# EAGLE design mainboard_v6.0.3 (EAGLE 9.6.2)
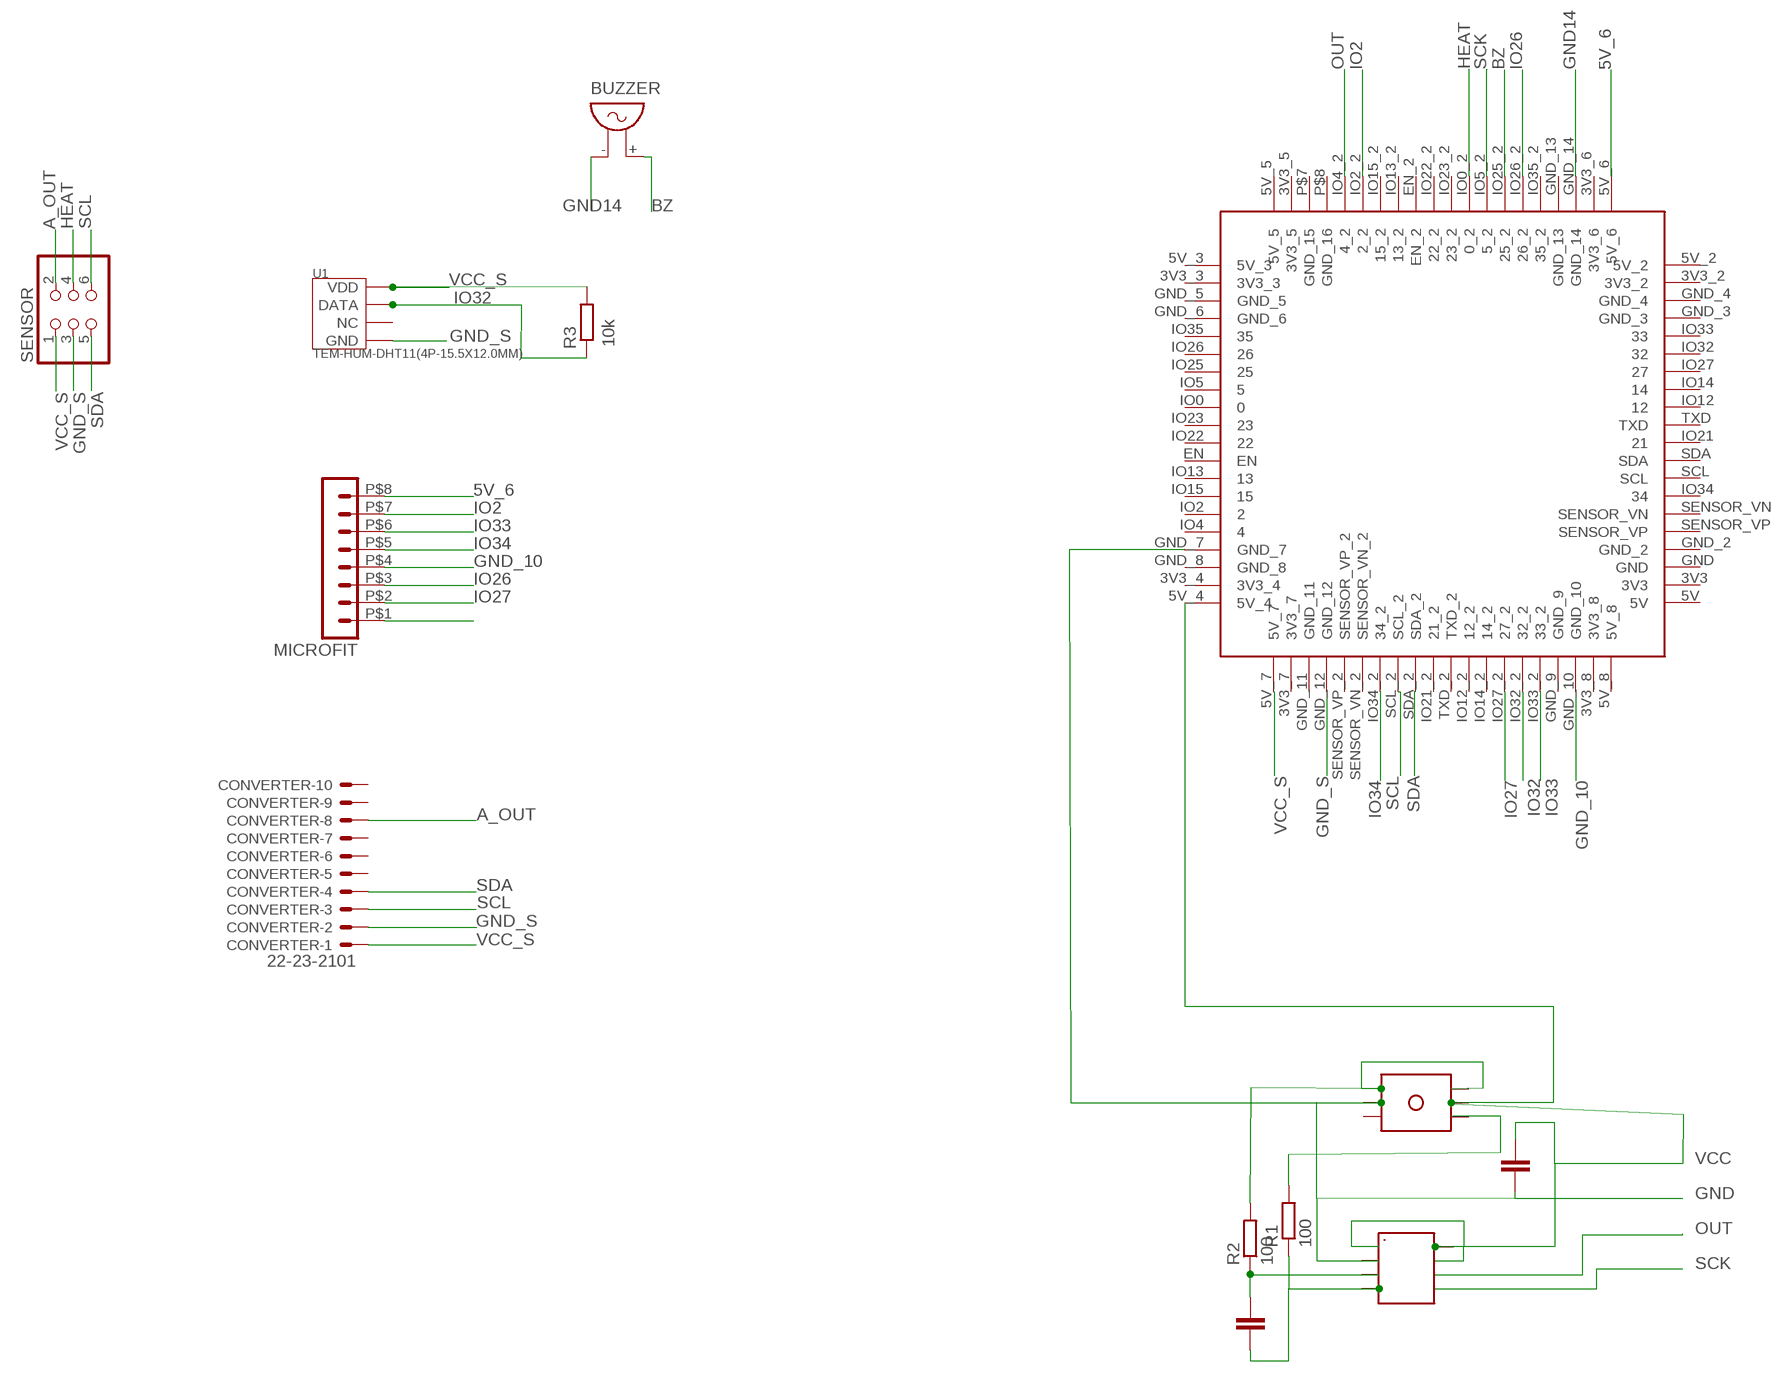
[diagram p0: schematic, sheet 1]

## Parts
BUZZER  F/QMX  [F/QMX]
C1  100n  C-EUC0805  [C0805]
C2  100n  C-EUC0805  [C0805]
CONVERTER  22-23-2101  [22-23-2101]
MICROFIT  HEADER_POS8_43045-0800  [43045-0800]
R1  100  R-EU_R0805  [R0805]
R2  100  R-EU_R0805  [R0805]
R3  10k  R-EU_R0805  [R0805]
SENSOR  PINHD-2X3  [2X03]
U1  TEM-HUM-DHT11(4P-15.5X12.0MM)  [SNR4-2.54-15.5X12.0X5.5MM]
U$1  WT32_SC01WT32_D  [WT32_DUPLICATED]
U$2  HX710B  [HX710B_SMD]
U$3  PRESSUREPRESSURE_PTH  [PRESSURE_PTH]

## Nets
5V_6: MICROFIT.P$8 U$1.5V_6
A_OUT: CONVERTER.8 SENSOR.2
BZ: BUZZER.+ U$1.IO25_2(25_2)
GND: C2.2 U$1.GND_7 U$2.AGND U$3.2
GND14: BUZZER.- U$1.GND_14
GND_10: MICROFIT.P$4 U$1.GND_10
GND_S: CONVERTER.2 SENSOR.3 U1.4(GND) U$1.GND_12
HEAT: SENSOR.4 U$1.IO0_2(0_2)
IO2: MICROFIT.P$7 U$1.IO2_2(2_2)
IO26: MICROFIT.P$3 U$1.IO26_2(26_2)
IO27: MICROFIT.P$2 U$1.IO27_2(27_2)
IO32: R3.1 U1.2(DATA) U$1.IO32_2(32_2)
IO33: MICROFIT.P$6 U$1.IO33_2(33_2)
IO34: MICROFIT.P$5 U$1.IO34_2(34_2)
N$1: C1.2 R2.1 U$2.INN
N$2: C1.1 R1.1 U$2.INP
N$5: R1.2 U$3.4
N$7: R2.2 U$3.1 U$3.6
N$8: MICROFIT.P$1
OUT: U$1.IO4_2(4_2) U$2.DOUT
SCK: U$1.IO5_2(5_2) U$2.SCK
SCL: CONVERTER.3 SENSOR.6 U$1.SCL_2
SDA: CONVERTER.4 SENSOR.5 U$1.SDA_2
VCC: C2.1 U$1.5V_4 U$2.AVDD U$2.DVDD U$2.VREF U$3.5
VCC_S: CONVERTER.1 R3.2 SENSOR.1 U1.1(VDD) U$1.5V_7
Unconnected: CONVERTER.5 CONVERTER.6 CONVERTER.7 CONVERTER.9 CONVERTER.10 U1.3(NC) U$1.3V3 U$1.3V3_2 U$1.3V3_3 U$1.3V3_4 U$1.3V3_5 U$1.3V3_6 U$1.3V3_7 U$1.3V3_8 U$1.5V U$1.5V_2 U$1.5V_3 U$1.5V_5 U$1.5V_8 U$1.EN U$1.EN_2 U$1.GND U$1.GND_2 U$1.GND_3 U$1.GND_4 U$1.GND_5 U$1.GND_6 U$1.GND_8 U$1.GND_9 U$1.GND_11 U$1.GND_13 U$1.IO0 U$1.IO2 U$1.IO4 U$1.IO5 U$1.IO12 U$1.IO12_2(12_2) U$1.IO13 U$1.IO13_2(13_2) U$1.IO14 U$1.IO14_2(14_2) U$1.IO15 U$1.IO15_2(15_2) U$1.IO21 U$1.IO21_2(21_2) U$1.IO22 U$1.IO22_2(22_2) U$1.IO23 U$1.IO23_2(23_2) U$1.IO25 U$1.IO26 U$1.IO27 U$1.IO32 U$1.IO33 U$1.IO34 U$1.IO35 U$1.IO35_2(35_2) U$1.P$7(GND_15) U$1.P$8(GND_16) U$1.SCL U$1.SDA U$1.SENSOR_VN U$1.SENSOR_VN_2 U$1.SENSOR_VP U$1.SENSOR_VP_2 U$1.TXD U$1.TXD_2 U$3.3

## Library data of the parts
BUZZER = buzzer:F/QMX: BUZZER Source: Buerklin; OC_FARNELL: unknown; OC_NEWARK: unknown
C1 C2 = rcl@1:C-EU: CAPACITOR, European symbol
CONVERTER = con-molex:22-23-2101: .100" (2.54mm) Center Header - 10 Pin; MF: MOLEX; MPN: 22-23-2101; OC_FARNELL: 1756828; OC_NEWARK: 94C0765
MICROFIT = con-molex-micro-fit-3_0 (1):HEADER_POS8_?: Molex - Micro-Fit 3.0 Series connector, 3.00mm (0.118") pitch header, 8 positions.
R1-R3 = rcl:R-EU_: RESISTOR, European symbol; SPICEPREFIX: R
SENSOR = pinhead:PINHD-2X3: PIN HEADER
U1 = TEM-HUM-DHT11_4P-15.5X12.0MM_:TEM-HUM-DHT11(4P-15.5X12.0MM): 314010000 Check availability <https://pricing.snapeda.com/parts/DHT11/Panasonic%20Industrial%20Automation%20Sales/view-part?ref=eda>; AVAILABILITY: Not in stock; CHECK_PRICES: https://www.snapeda.com/parts/DHT11/Panasonic/view-part/?ref=eda; DESCRIPTION: Servo AC 100 ~ 120VAC Supply 10A 120V Load; MF: Panasonic Industrial Automation Sales; MP: DHT11; PACKAGE: None; PRICE: None; SNAPEDA_LINK: https://www.snapeda.com/parts/DHT11/Panasonic/view-part/?ref=snap
U$1 = WT32_SC01:WT32_SC01
U$2 = HX710B:HX710B
U$3 = PRESSURE:PRESSURE

## Board
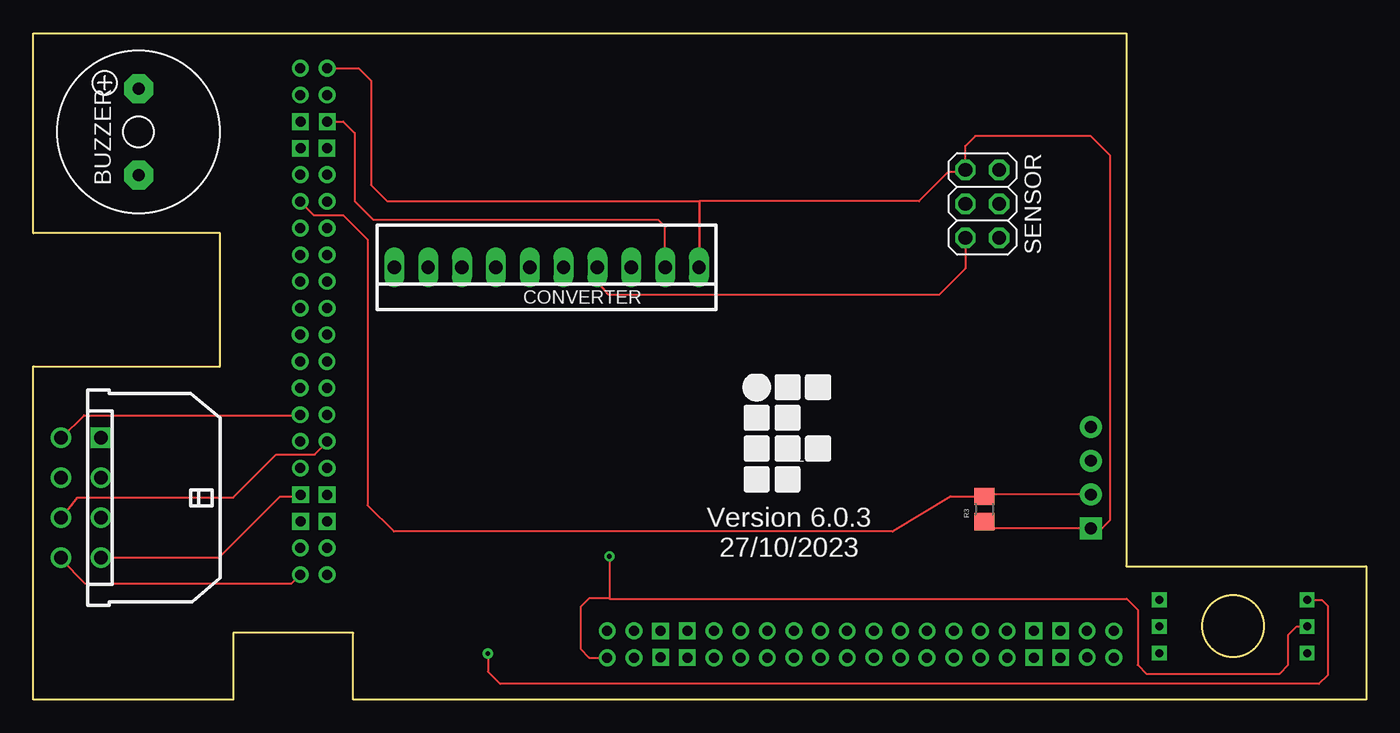
[diagram p1: board, top side]
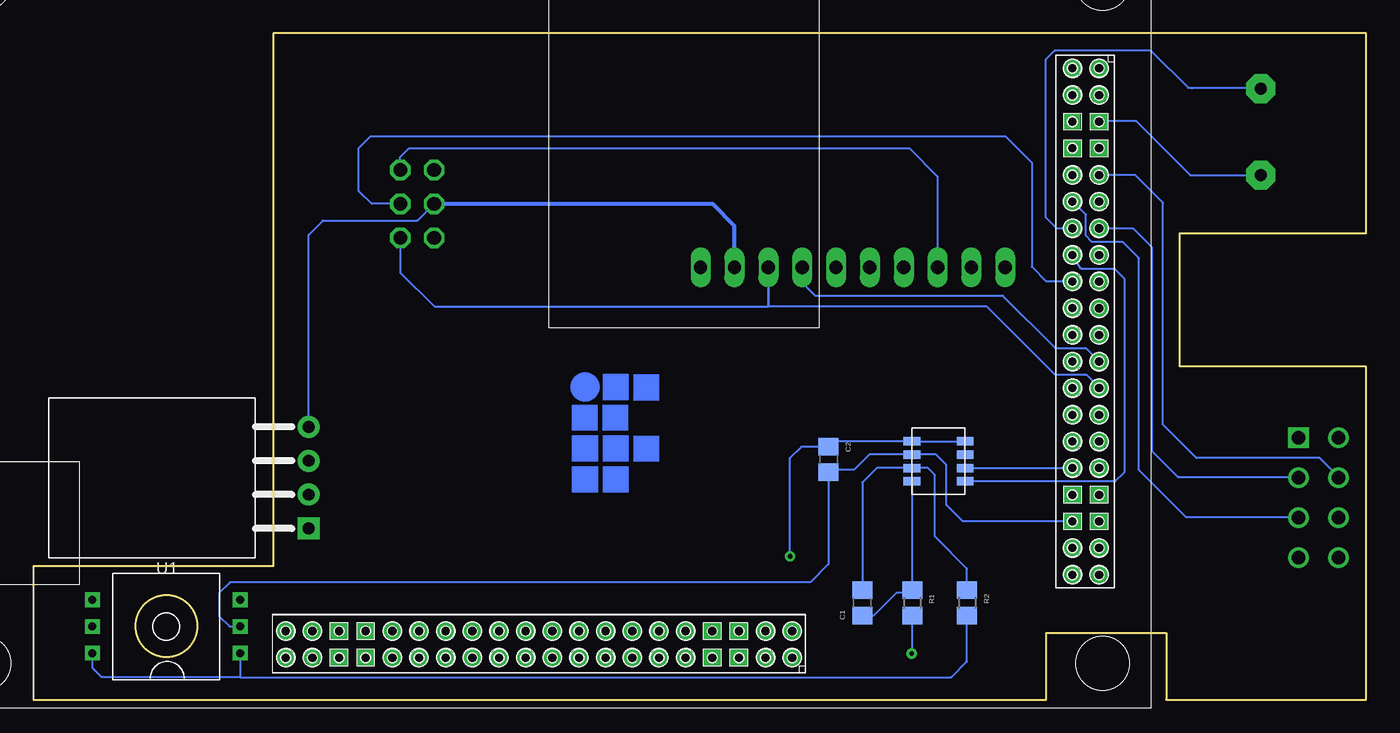
[diagram p2: board, bottom side, seen from below]

Size 100 x 50 mm. Coordinates in mm from the lower left corner, seen from the top.
Outline: 0,0 0,25 14,25 14,35 0,35 0,50 82,50 82,10 100,10 100,0 24,0 24,5 15,5 15,0 0,0
Outline: circle at 90,5.5 radius 2.3
Copper layers (1*16): Top 0.035mm / dielectric 1.5mm / Bottom 0.035mm
Design rules "default": minimum track width 6mil, minimum drill 0.35mm, track to track 6mil, track to pad 6mil, pad to pad 6mil, via to via 6mil, smd to smd 6mil, copper to edge 40mil, drill to drill 6mil, minimum pad ring 10mil, minimum via ring 8mil, stop-mask expansion 4mil, vias tented up to drill 0mil, thermal gap 10mil

### Footprints (pad centres in the part's own frame; a part is rotated, then mirrored left to right if it is on the bottom)
F/QMX = drill 0.914 pad 2.159 octagon: + 3.251,0; - -3.251,0
C0805 = smd 1.3 x 1.5: 1 -0.95,0; 2 0.95,0
22-23-2101 = drill 1 long: 1 -11.43,0; 2 -8.89,0; 3 -6.35,0; 4 -3.81,0; 5 -1.27,0; 6 1.27,0; 7 3.81,0; 8 6.35,0; 9 8.89,0; 10 11.43,0
43045-0800 = drill 1.02 square: P$1 4.5,4.32 | drill 1.02: P$2 1.5,4.32; P$3 -1.5,4.32; P$4 -4.5,4.32; P$5 4.5,7.32; P$6 1.5,7.32; P$7 -1.5,7.32; P$8 -4.5,7.32
R0805 = smd 1.3 x 1.5: 1 -0.95,0; 2 0.95,0
2X03 = drill 1.016 octagon: 1 -2.54,-1.27; 2 -2.54,1.27; 3 0,-1.27; 4 0,1.27; 5 2.54,-1.27; 6 2.54,1.27
SNR4-2.54-15.5X12.0X5.5MM = drill 0.889 pad 1.651 square: 1 -11.75,3.81 | drill 0.889 pad 1.651: 2 -11.75,1.27; 3 -11.75,-1.27; 4 -11.75,-3.81
WT32_DUPLICATED = drill 0.75: 3V3 -34.46,-21.65; 3V3_2 -34.47,-23.64; 3V3_3 -0.47,-21.65; 3V3_4 -0.47,-23.66; 3V3_5 22.56,-15.42; 3V3_6 24.57,-15.42; 3V3_7 22.56,18.57; 3V3_8 24.57,18.57; 5V -36.47,-21.66; 5V_2 -36.46,-23.65; 5V_3 1.54,-21.65; 5V_4 1.54,-23.66; 5V_5 22.56,-17.43; 5V_6 24.57,-17.43; 5V_7 22.56,20.58; 5V_8 24.57,20.58; EN -20.46,-21.65; EN_2 22.57,-1.43; IO0 -14.46,-21.65; IO0_2 22.56,4.58; IO2 -26.46,-21.66; IO2_2 22.56,-7.42; IO4 -28.46,-21.66; IO4_2 22.56,-9.43; IO5 -12.46,-21.65; IO5_2 22.56,6.57; IO12 -14.46,-23.65; IO12_2 24.57,4.58; IO13 -22.46,-21.66; IO13_2 22.57,-3.42; IO14 -12.46,-23.66; IO14_2 24.57,6.57; IO15 -24.46,-21.66; IO15_2 22.57,-5.43; IO21 -18.46,-23.65; IO21_2 24.58,0.58; IO22 -18.47,-21.66; IO22_2 22.57,0.58; IO23 -16.46,-21.66; IO23_2 22.56,2.57; IO25 -10.47,-21.65; IO25_2 22.56,8.58; IO26 -8.47,-21.65; IO26_2 22.56,10.58; IO27 -10.47,-23.66; IO27_2 24.57,8.58; IO32 -8.47,-23.66; IO32_2 24.57,10.58; IO33 -6.46,-23.66; IO33_2 24.57,12.59; IO34 -24.47,-23.66; IO34_2 24.58,-5.43; IO35 -6.46,-21.65; IO35_2 22.56,12.59; SCL -22.45,-23.66; SCL_2 24.58,-3.42; SDA -20.47,-23.66; SDA_2 24.58,-1.43; SENSOR_VN -26.47,-23.66; SENSOR_VN_2 24.57,-7.42; SENSOR_VP -28.47,-23.66; SENSOR_VP_2 24.57,-9.43; TXD -16.47,-23.66; TXD_2 24.57,2.57 | drill 0.75 square: GND -32.47,-21.65; GND_2 -30.47,-21.65; GND_3 -32.47,-23.65; GND_4 -30.47,-23.65; GND_5 -4.47,-21.65; GND_6 -2.46,-21.66; GND_7 22.56,-13.43; GND_8 22.56,-11.43; GND_9 24.55,-13.43; GND_10 24.55,-11.43; GND_11 22.57,14.58; GND_12 22.54,16.57; GND_13 24.56,14.57; GND_14 24.56,16.56; P$7 -4.47,-23.65; P$8 -2.47,-23.64
HX710B_SMD = smd 1.27 x 0.635: AGND -5,4; AVDD -1,5; DOUT -1,3; DVDD -1,4; INN -5,3; INP -5,2; SCK -1,2; VREF -5,5
PRESSURE_PTH = drill 0.6 square: 1 -10.54,7; 2 -10.54,5; 3 -10.54,3; 4 0.54,3; 5 0.54,5; 6 0.54,7

### Placement (x,y rotation side)
BUZZER  7.9,42.6 90 top
C1  37.81,7.25 90 bottom
C2  40.33,18.02 270 bottom
CONVERTER  38.51,32.45 180 top
MICROFIT  9.4,15.15 90 top
R1  34.06,7.25 270 bottom
R2  29.94,7.25 270 bottom
R3  71.35,14.3 270 top
SENSOR  71.2,37.2 270 top
U1  91.1,16.65 180 bottom
U$1  44.6,26.8 0 bottom
U$2  29.09,14.38 0 bottom
U$3  95.03,10.48 180 bottom

### Tracks (layer width: path | path; a pad name or v marks a point on that pad's centre or on a via)
5V_6
  Top 0.152: U$1.5V_6 19.36,8.7 3.9,8.7 2.08,10.52 MICROFIT.P$8
A_OUT
  Bottom 0.152: CONVERTER.8 32.16,39.25 34.28,41.37 71.82,41.37 72.47,40.72 SENSOR.2
BZ
  Bottom 0.152: 13.05,45.85 13.11,45.91 | U$1.IO25_2 23.24,35.38 24.06,36.2 24.06,48.01 23.38,48.69 16.14,48.69 13.36,45.91 13.11,45.91 | 13.11,45.91 7.96,45.91 BUZZER.+
GND
  Bottom 0.152: U$3.2 85.28,5.48 86.05,6.25 86.05,8 85.25,8.8 41.7,8.8 40.33,10.17 C2.2 40.13,17.27 38.38,17.27 37.27,18.38 U$2.AGND 32.28,18.38 31.5,17.6 31.5,14.6 30.27,13.37 U$1.GND_7
GND14
  Bottom 0.152: U$1.GND_14 20,43.4 17.25,43.4 13.2,39.35 BUZZER.-
GND_10
  Top 0.152: U$1.GND_10 19.96,15.24 18.5,15.24 13.91,10.65 MICROFIT.P$4
GND_S
  Top 0.152: U$1.GND_12 23.26,43.37 24.11,42.52 24.11,37.42 25.55,35.98 46.9,35.98 47.4,35.48 CONVERTER.2
  Bottom 0.152: U1.4 79.35,34.86 78.26,35.95 71.18,35.95 SENSOR.3
  Bottom 0.305: SENSOR.3 49.05,37.2 47.4,35.55 CONVERTER.2
HEAT
  Bottom 0.152: SENSOR.4 74.61,37.2 75.58,38.17 75.58,41.4 74.71,42.27 27.06,42.27 25.09,40.3 25.09,32.48 23.99,31.38 U$1.IO0_2
IO2
  Top 0.152: U$1.IO2_2 22.04,19.31 21.12,18.39 18.23,18.39 15.01,15.17 3.31,15.17 MICROFIT.P$7
IO26
  Bottom 0.152: MICROFIT.P$3 5.13,13.7 13.52,13.7 17.05,17.23 17.05,33.13 18.26,34.34 20.57,34.34 21.03,34.8 21.03,36.41 21.95,37.33 21.95,37.34 U$1.IO26_2
IO27
  Bottom 0.152: U$1.IO27_2 17.49,35.38 16.05,33.93 16.05,18.63 14.12,16.71 5.14,16.71 MICROFIT.P$2
IO32
  Top 0.152: U1.2 71.48,15.38 R3.1 68.84,15.25 64.48,12.61 27.05,12.61 25.08,14.58 25.08,34.53 23.28,36.33 21.08,36.33 U$1.IO32_2
IO33
  Bottom 0.152: U$1.IO33_2 17.35,39.39 15.24,37.28 15.24,20.64 12.73,18.13 3.5,18.13 2.13,16.76 MICROFIT.P$6
IO34
  Top 0.152: U$1.IO34_2 19.96,21.34 3.81,21.34 2.13,19.66 MICROFIT.P$5
N$1
  Bottom 0.152: C1.2 37.81,16.29 36.72,17.38 U$2.INN 32.88,17.38 32.35,16.85 32.35,12.23 29.94,9.82 R2.1
N$2
  Bottom 0.152: U$2.INP 34.09,8.23 R1.1 34.23,8.04 35.21,8.04 36.95,6.3 C1.1
N$5  (via drill 0.35)
  Top 0.152: U$3.4 96.67,7.48 97.1,7.05 97.1,1.82 96.45,1.17 35.03,1.17 34.1,2.1 v34.1,3.45
  Bottom 0.152: R1.2 34.1,6.26 v34.1,3.45
N$7
  Bottom 0.152: R2.2 29.94,2.86 31.13,1.67 84.49,1.67 U$3.1 84.49,1.68 94.86,1.68 95.57,2.4 U$3.6
OUT
  Bottom 0.152: 30.14,17.32 30.09,17.37 U$2.DOUT U$1.IO4_2
SCK
  Bottom 0.152: U$2.SCK 30.09,16.36 18.84,16.36 18.15,17.05 18.15,31.6 18.91,32.36 21.39,32.36 U$1.IO5_2
SCL
  Top 0.152: 72.39,34.59 SENSOR.6
  Bottom 0.152: U$1.SCL_2 20.02,23.41 20.99,24.38 23.34,24.38 28.49,29.53 44.86,29.53 CONVERTER.3 44.86,29.5 69.91,29.5 72.47,32.06 SENSOR.6
SDA
  Top 0.152: 20,25.39 U$1.SDA_2 | SENSOR.5 69.93,32.35 67.96,30.38 43.16,30.38 42.32,31.38 CONVERTER.4
  Bottom 0.152: U$1.SDA_2 20.12,25.45 20.13,25.45 21.05,26.37 23.32,26.37 27.28,30.33 41.37,30.33 42.32,31.28 CONVERTER.4
VCC  (via drill 0.35)
  Top 0.152: 95.43,5.48 U$3.5 94.78,5.48 94.15,4.85 94.15,2.6 93.5,1.95 83.5,1.95 82.85,2.6 82.85,6.75 82.03,7.57 43.22,7.57 v43.22,10.74 43.22,7.59 41.69,7.59 41.06,6.96 41.06,3.79 41.71,3.14 U$1.5V_4
  Bottom 0.152: U$2.DVDD U$2.AVDD U$2.VREF 34.11,19.4 39.9,19.4 C2.1 42.38,18.97 43.22,18.13 v43.22,10.74 43.22,10.67
VCC_S
  Top 0.152: R3.2 71.61,12.84 U1.1 80.17,12.84 80.77,13.44 80.77,40.86 79.34,42.29 70.68,42.29 69.93,41.54 SENSOR.1 69.8,39.62 68.67,39.62 66.45,37.4 49.99,37.4 49.99,32.5 CONVERTER.1 49.94,37.39 26.56,37.39 25.34,38.61 25.34,46.43 24.39,47.38 U$1.5V_7
(copper drawn outside any net)
  shapes: Bottom area x9, Bottom circle x3

### Text on the board
tNames: Version 6.0.3 / 27/10/2023